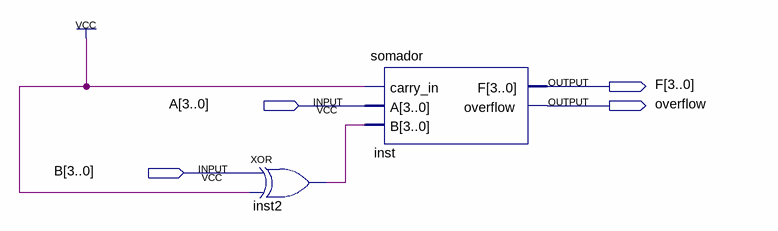
[diagram p0: schematic sheet]
// Quartus schematic subtrator.bdf as structural Verilog: 2 symbols, 4 pins
module subtrator (
  input  [3:0] A,
  input  [3:0] B,
  output [3:0] F,
  output overflow
);

  wire inst2_out;

  assign inst2_out = B ^ 4'b1111;  // XOR inst2, 4 bits wide
  somador inst (.carry_in(1'b1), .A(A), .B({4{inst2_out}}), .F(F), .overflow(overflow));
endmodule
